# EasyEDA schematic SCH_esp-firework-firing-system-v2.1.json
TITLE: Sheet_1; REV: 1.0; Date: 2023-05-22; Sheet: 1/1; Company: Your Company
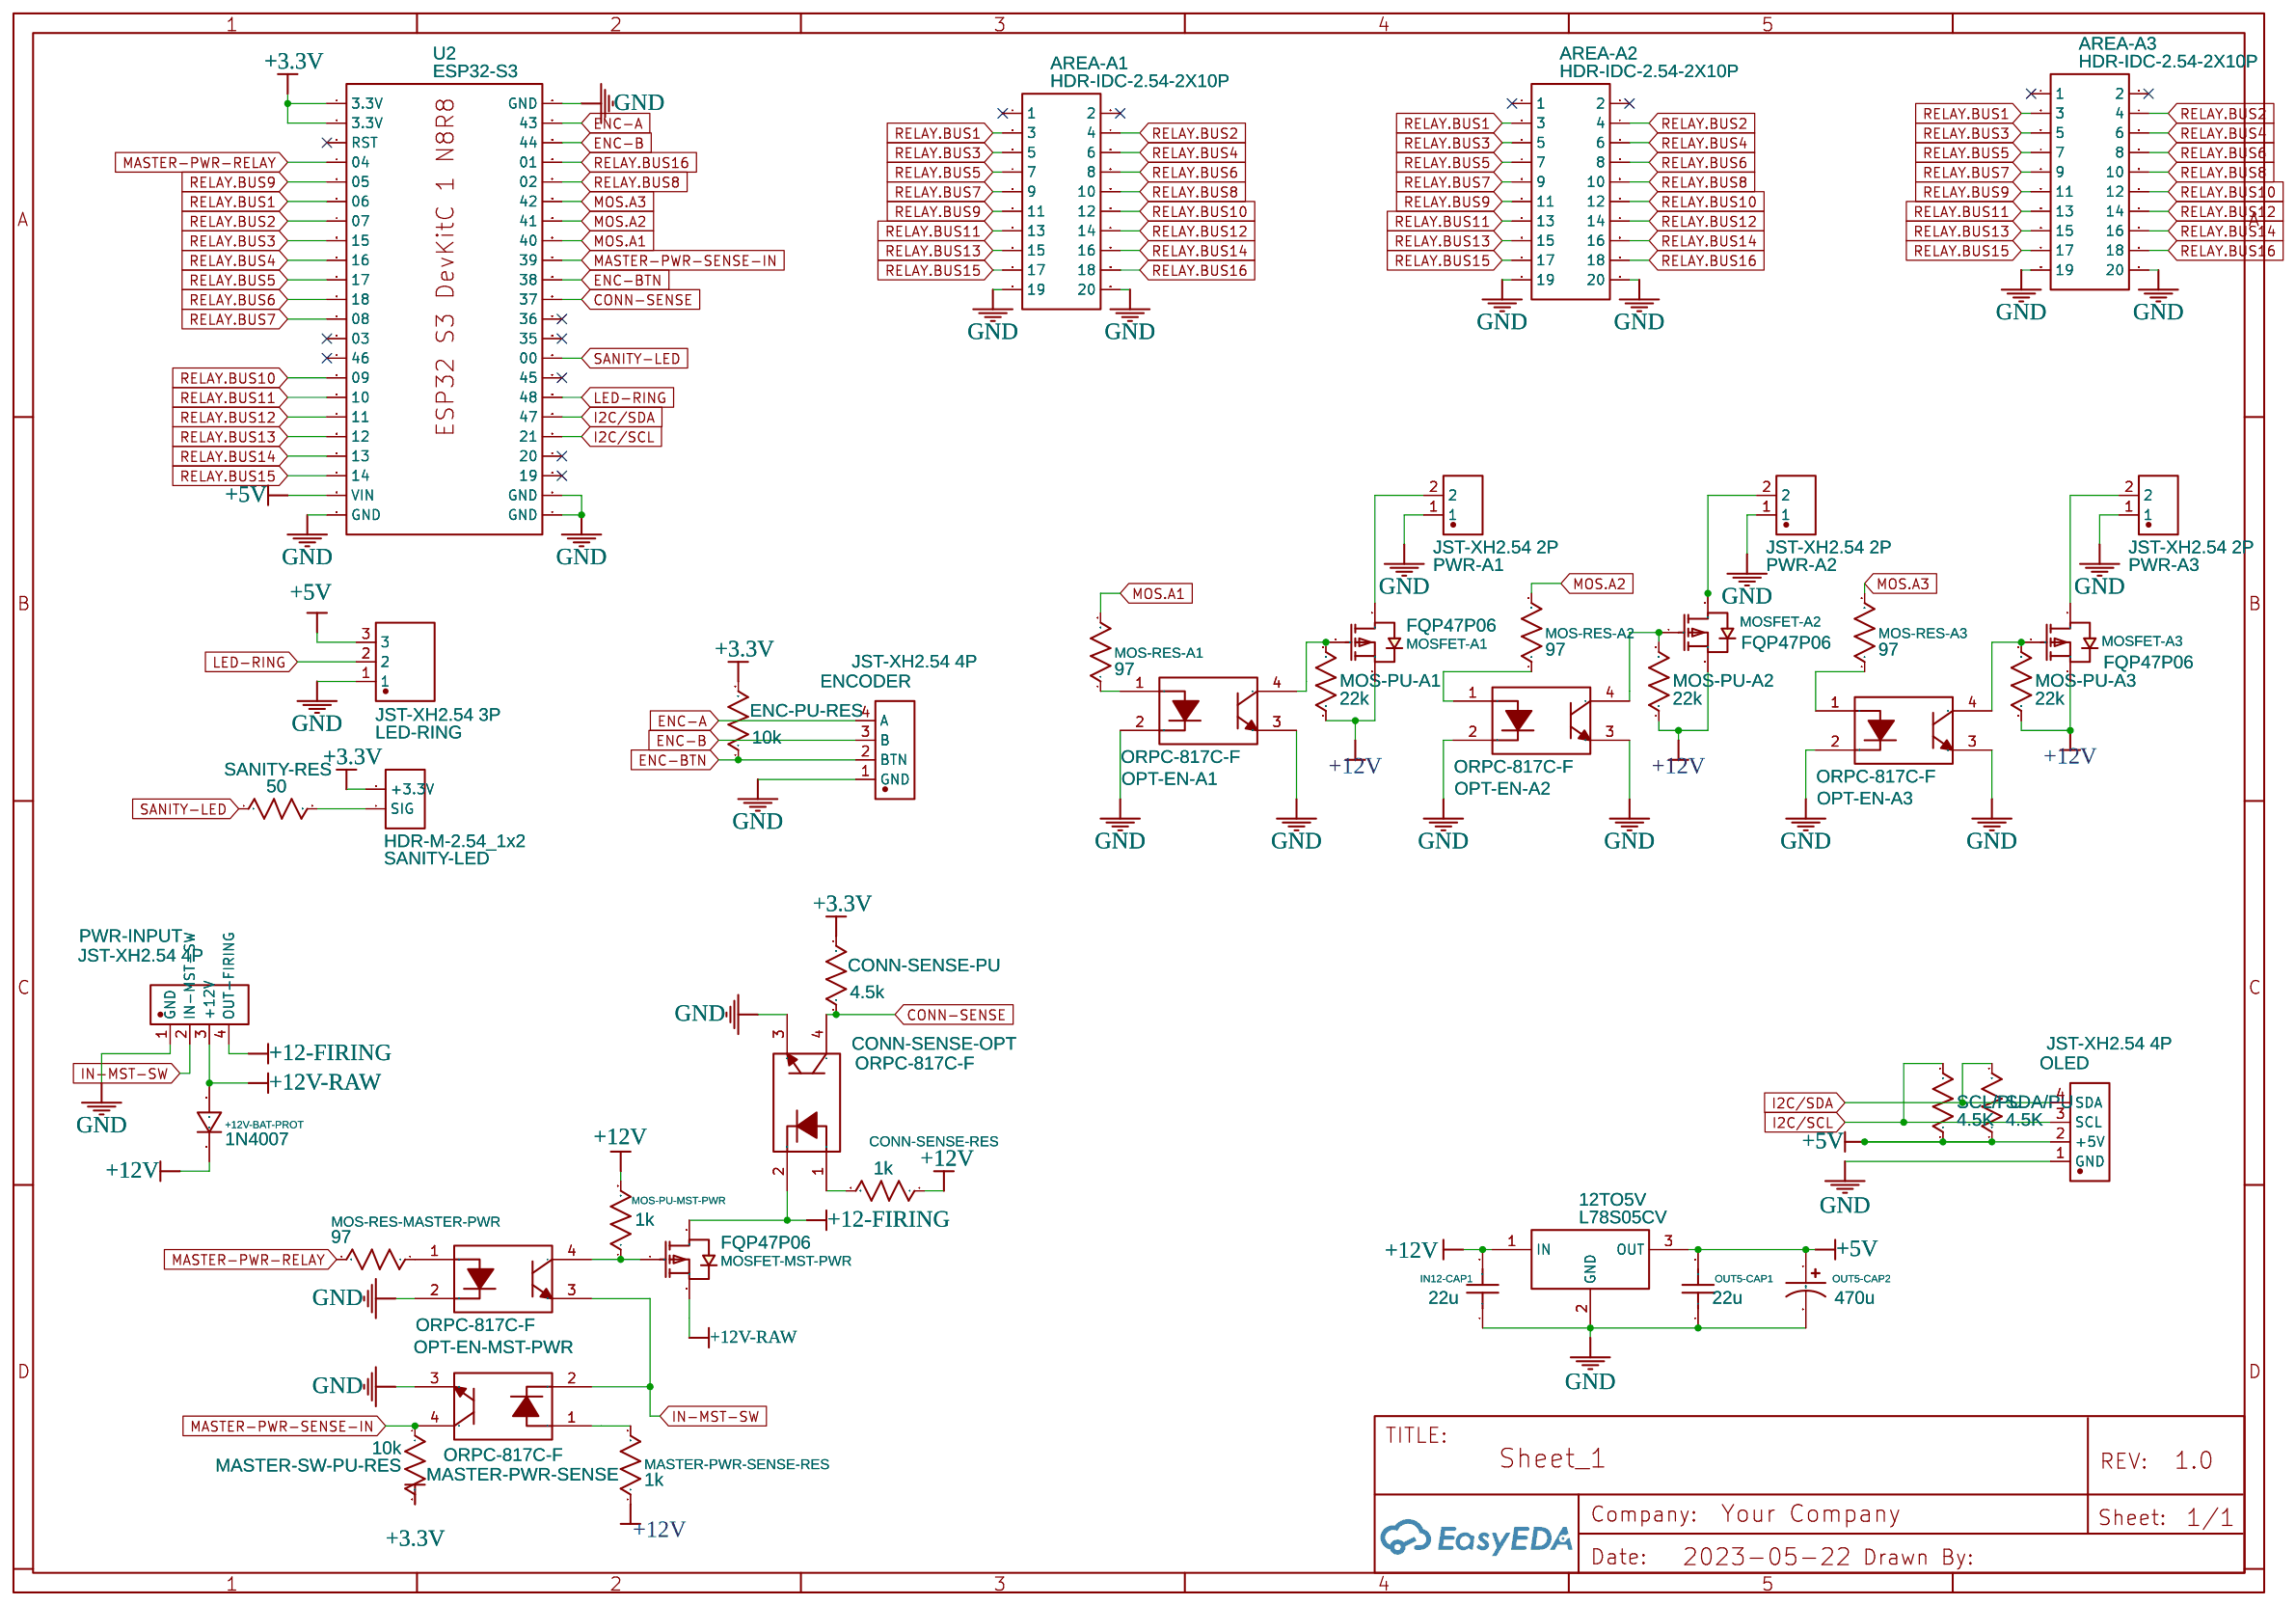
[diagram p0: schematic sheet]

## Parts
12TO5V  L78S05CV  [TO-220-3_L10.0-W4.5-P2.54-L]
+12V-BAT-PROT  1N4007  [DO-41_BD2.4-L4.7-P8.70-D0.9-RD]
AREA-A1  HDR-IDC-2.54-2X10P  [IDC-TH_20P-P2.54-V-R2-C10-S2.54]
AREA-A2  HDR-IDC-2.54-2X10P  [IDC-TH_20P-P2.54-V-R2-C10-S2.54]
AREA-A3  HDR-IDC-2.54-2X10P  [IDC-TH_20P-P2.54-V-R2-C10-S2.54]
CONN-SENSE-OPT  ORPC-817C-F  [DIP-4_L4.6-W6.5-P2.54-LS7.6-BR]
CONN-SENSE-PU  4.5k  [R_AXIAL-0.3]
CONN-SENSE-RES  1k  [R_AXIAL-0.3]
ENC-PU-RES  10k  [R_AXIAL-0.3]
ENCODER  JST-XH2.54 4P  [JST-XH2.54 4P]
IN12-CAP1  22u  [RAD-0.1]
LED-RING  JST-XH2.54 3P  [JST-XH2.54 3P]
MASTER-PWR-SENSE  ORPC-817C-F  [DIP-4_L4.6-W6.5-P2.54-LS7.6-BR]
MASTER-PWR-SENSE-RES  1k  [R_AXIAL-0.3]
MASTER-SW-PU-RES  10k  [R_AXIAL-0.3]
MOS-PU-A1  22k  [R_AXIAL-0.3]
MOS-PU-A2  22k  [R_AXIAL-0.3]
MOS-PU-A3  22k  [R_AXIAL-0.3]
MOS-PU-MST-PWR  1k  [R_AXIAL-0.3]
MOS-RES-A1  97  [R_AXIAL-0.3]
MOS-RES-A2  97  [R_AXIAL-0.3]
MOS-RES-A3  97  [R_AXIAL-0.3]
MOS-RES-MASTER-PWR  97  [R_AXIAL-0.3]
MOSFET-A1  FQP47P06  [TO-220F-3_L10.2-W4.9-P2.54-L]
MOSFET-A2  FQP47P06  [TO-220F-3_L10.2-W4.9-P2.54-L]
MOSFET-A3  FQP47P06  [TO-220F-3_L10.2-W4.9-P2.54-L]
MOSFET-MST-PWR  FQP47P06  [TO-220F-3_L10.2-W4.9-P2.54-L]
OLED  JST-XH2.54 4P  [JST-XH2.54 4P]
OPT-EN-A1  ORPC-817C-F  [DIP-4_L4.6-W6.5-P2.54-LS7.6-BR]
OPT-EN-A2  ORPC-817C-F  [DIP-4_L4.6-W6.5-P2.54-LS7.6-BR]
OPT-EN-A3  ORPC-817C-F  [DIP-4_L4.6-W6.5-P2.54-LS7.6-BR]
OPT-EN-MST-PWR  ORPC-817C-F  [DIP-4_L4.6-W6.5-P2.54-LS7.6-BR]
OUT5-CAP1  22u  [RAD-0.1]
OUT5-CAP2  470u  [CAP-D6.3×F2.5]
PWR-A1  JST-XH2.54 2P  [JST-XH2.54 2P]
PWR-A2  JST-XH2.54 2P  [JST-XH2.54 2P]
PWR-A3  JST-XH2.54 2P  [JST-XH2.54 2P]
PWR-INPUT  JST-XH2.54 4P  [JST-XH2.54 4P]
SANITY-LED  HDR-M-2.54_1x2  [HDR-M-2.54_1X2]
SANITY-RES  50  [R_AXIAL-0.3]
SCL/PU  4.5K  [R_AXIAL-0.3]
SDA/PU  4.5K  [R_AXIAL-0.3]
U2  ESP32-S3  [ESP32-S3-DEVKITC-1-N8R8]

## Library data of the parts
12TO5V = L78S05CV: Supplier: LCSC; Manufacturer: ST(意法半导体); Supplier Part: C33043; JLCPCB Part Class: Extended Part
+12V-BAT-PROT = 1N4007: Supplier: LCSC; Manufacturer: SEMTECH; Supplier Part: C106903; Contributor: LCEDA_Lib
AREA-A1-AREA-A3 = HDR-IDC-2.54-2X10P: Supplier: LCSC; Manufacturer: BOOMELE; Manufacturer Part: IDC Box 2.54mm 2X10P　Straight; image: //image.lceda.cn/szlcsc/C3405.jpg; Supplier Part: C3405
CONN-SENSE-OPT MASTER-PWR-SENSE OPT-EN-A1-OPT-EN-A3 OPT-EN-MST-PWR = ORPC-817C-F: Supplier: LCSC; Supplier Part: C2842770; Manufacturer: Orient(奥伦德); Contributor: LCSC; JLCPCB Part Class: Extended Part
CONN-SENSE-PU CONN-SENSE-RES ENC-PU-RES MASTER-PWR-SENSE-RES MASTER-SW-PU-RES MOS-PU-A1-MOS-PU-A3 MOS-PU-MST-PWR MOS-RES-A1-MOS-RES-A3 MOS-RES-MASTER-PWR SANITY-RES SCL/PU SDA/PU = R_AXIAL-0.3_US: Contributor: LCEDA_Lib
ENCODER OLED PWR-INPUT = JST-XH2.54 4P: Supplier: CQRobot; link: https://www.amazon.fr/dp/B01EQGNZ2I/?coliid=IQPWZUUK7M1P0&colid=2CFFEVMK4YZ12&ref_=lv_ov_lig_dp_it_im&th=1; Contributor: marierigal4
IN12-CAP1 OUT5-CAP1 = C_RAD-0.1_US: Contributor: LCEDA_Lib
LED-RING = JST-XH2.54 3P: Supplier: CQRobot; link: https://www.amazon.fr/dp/B01EQGNZ2I/?coliid=IQPWZUUK7M1P0&colid=2CFFEVMK4YZ12&ref_=lv_ov_lig_dp_it_im&th=1; Contributor: Martin Hoštak
MOSFET-A1-MOSFET-A3 MOSFET-MST-PWR = FQP47P06: Supplier: LCSC; Supplier Part: C462765; Manufacturer: onsemi(安森美); Contributor: LCSC; JLCPCB Part Class: Extended Part
OUT5-CAP2 = CE_TH_D6.3×F2.5_US: Contributor: LCEDA_Lib
PWR-A1-PWR-A3 = JST-XH2.54 2P: Supplier: CQRobot; link: https://www.amazon.fr/dp/B01EQGNZ2I/?coliid=IQPWZUUK7M1P0&colid=2CFFEVMK4YZ12&ref_=lv_ov_lig_dp_it_im&th=1; Contributor: marierigal4
SANITY-LED = HDR-M-2.54_1x2: Supplier Part: C124375; Supplier: LCSC; Contributor: LCEDA_Lib
U2 = ESP32-S3: Contributor: moreauf

## Nets
+3.3V: CONN-SENSE-PU.2 ENC-PU-RES.2 MASTER-SW-PU-RES.2 SANITY-LED.2(+3.3V) U2.1(3.3V) U2.2(3.3V)
+5V: 12TO5V.3(OUT) LED-RING.3 OLED.2(+5V) OUT5-CAP1.2 OUT5-CAP2.1 SCL/PU.1 SDA/PU.1 U2.21(VIN)
+12V: 12TO5V.1(IN) +12V-BAT-PROT.1 CONN-SENSE-RES.1 IN12-CAP1.2 MASTER-PWR-SENSE-RES.1 MOS-PU-A1.1 MOS-PU-A2.1 MOS-PU-A3.1 MOS-PU-MST-PWR.2 MOSFET-A1.3(S) MOSFET-A2.3(S) MOSFET-A3.3(S)
+12V-RAW: +12V-BAT-PROT.2 MOSFET-MST-PWR.3(S) PWR-INPUT.3(+12V)
GND: 12TO5V.2(GND) AREA-A1.19 AREA-A1.20 AREA-A2.19 AREA-A2.20 AREA-A3.19 AREA-A3.20 CONN-SENSE-OPT.3 ENCODER.1(GND) IN12-CAP1.1 LED-RING.1 MASTER-PWR-SENSE.3 OLED.1(GND) OPT-EN-A1.2 OPT-EN-A1.3 OPT-EN-A2.2 OPT-EN-A2.3 OPT-EN-A3.2 OPT-EN-A3.3 OPT-EN-MST-PWR.2 OUT5-CAP1.1 OUT5-CAP2.2 PWR-A1.1 PWR-A2.1 PWR-A3.1 PWR-INPUT.1(GND) U2.22(GND) U2.23(GND) U2.43(GND) U2.44(GND)
+12-FIRING: CONN-SENSE-OPT.2 MOSFET-MST-PWR.2(D) PWR-INPUT.4(OUT-FIRING)
CONN-SENSE: CONN-SENSE-OPT.4 CONN-SENSE-PU.1 U2.33(37)
ENC-A: ENCODER.4(A) U2.24(43)
ENC-B: ENCODER.3(B) U2.25(44)
ENC-BTN: ENC-PU-RES.1 ENCODER.2(BTN) U2.32(38)
I2C/SCL: OLED.3(SCL) SCL/PU.2 U2.40(21)
I2C/SDA: OLED.4(SDA) SDA/PU.2 U2.39(47)
IN-MST-SW: MASTER-PWR-SENSE.2 OPT-EN-MST-PWR.3 PWR-INPUT.2(IN-MST-SW)
LED-RING: LED-RING.2 U2.38(48)
MASTER-PWR-RELAY: MOS-RES-MASTER-PWR.2 U2.4(04)
MASTER-PWR-SENSE-IN: MASTER-PWR-SENSE.4 MASTER-SW-PU-RES.1 U2.31(39)
MOS.A1: MOS-RES-A1.2 U2.30(40)
MOS.A2: MOS-RES-A2.2 U2.29(41)
MOS.A3: MOS-RES-A3.2 U2.28(42)
RELAY.BUS1: AREA-A1.3 AREA-A2.3 AREA-A3.3 U2.6(06)
RELAY.BUS2: AREA-A1.4 AREA-A2.4 AREA-A3.4 U2.7(07)
RELAY.BUS3: AREA-A1.5 AREA-A2.5 AREA-A3.5 U2.8(15)
RELAY.BUS4: AREA-A1.6 AREA-A2.6 AREA-A3.6 U2.9(16)
RELAY.BUS5: AREA-A1.7 AREA-A2.7 AREA-A3.7 U2.10(17)
RELAY.BUS6: AREA-A1.8 AREA-A2.8 AREA-A3.8 U2.11(18)
RELAY.BUS7: AREA-A1.9 AREA-A2.9 AREA-A3.9 U2.12(08)
RELAY.BUS8: AREA-A1.10 AREA-A2.10 AREA-A3.10 U2.27(02)
RELAY.BUS9: AREA-A1.11 AREA-A2.11 AREA-A3.11 U2.5(05)
RELAY.BUS10: AREA-A1.12 AREA-A2.12 AREA-A3.12 U2.15(09)
RELAY.BUS11: AREA-A1.13 AREA-A2.13 AREA-A3.13 U2.16(10)
RELAY.BUS12: AREA-A1.14 AREA-A2.14 AREA-A3.14 U2.17(11)
RELAY.BUS13: AREA-A1.15 AREA-A2.15 AREA-A3.15 U2.18(12)
RELAY.BUS14: AREA-A1.16 AREA-A2.16 AREA-A3.16 U2.19(13)
RELAY.BUS15: AREA-A1.17 AREA-A2.17 AREA-A3.17 U2.20(14)
RELAY.BUS16: AREA-A1.18 AREA-A2.18 AREA-A3.18 U2.26(01)
SANITY-LED: SANITY-RES.1 U2.36(00)
Net-(CONN-SENSE-OPT-1): CONN-SENSE-OPT.1 CONN-SENSE-RES.2
Net-(MASTER-PWR-SENSE-1): MASTER-PWR-SENSE.1 MASTER-PWR-SENSE-RES.2
Net-(MOS-PU-A1-2): MOS-PU-A1.2 MOSFET-A1.1(G) OPT-EN-A1.4
Net-(MOS-PU-A2-2): MOS-PU-A2.2 MOSFET-A2.1(G) OPT-EN-A2.4
Net-(MOS-PU-A3-2): MOS-PU-A3.2 MOSFET-A3.1(G) OPT-EN-A3.4
Net-(MOS-PU-MST-PWR-1): MOS-PU-MST-PWR.1 MOSFET-MST-PWR.1(G) OPT-EN-MST-PWR.4
Net-(MOS-RES-A1-1): MOS-RES-A1.1 OPT-EN-A1.1
Net-(MOS-RES-A2-1): MOS-RES-A2.1 OPT-EN-A2.1
Net-(MOS-RES-A3-1): MOS-RES-A3.1 OPT-EN-A3.1
Net-(MOS-RES-MASTER-PWR-1): MOS-RES-MASTER-PWR.1 OPT-EN-MST-PWR.1
Net-(MOSFET-A1-2): MOSFET-A1.2(D) PWR-A1.2
Net-(MOSFET-A2-2): MOSFET-A2.2(D) PWR-A2.2
Net-(MOSFET-A3-2): MOSFET-A3.2(D) PWR-A3.2
Net-(SANITY-LED-1): SANITY-LED.1(SIG) SANITY-RES.2

Not connected (* = marked no-connect by the designer): AREA-A1 1* 2*; AREA-A2 1* 2*; AREA-A3 1* 2*; U2 3(RST)* 13(03)* 14(46)* 34(36)* 35* 37(45)* 41(20)* 42(19)*
